# EAGLE schematic Power (EAGLE 7.1.0)
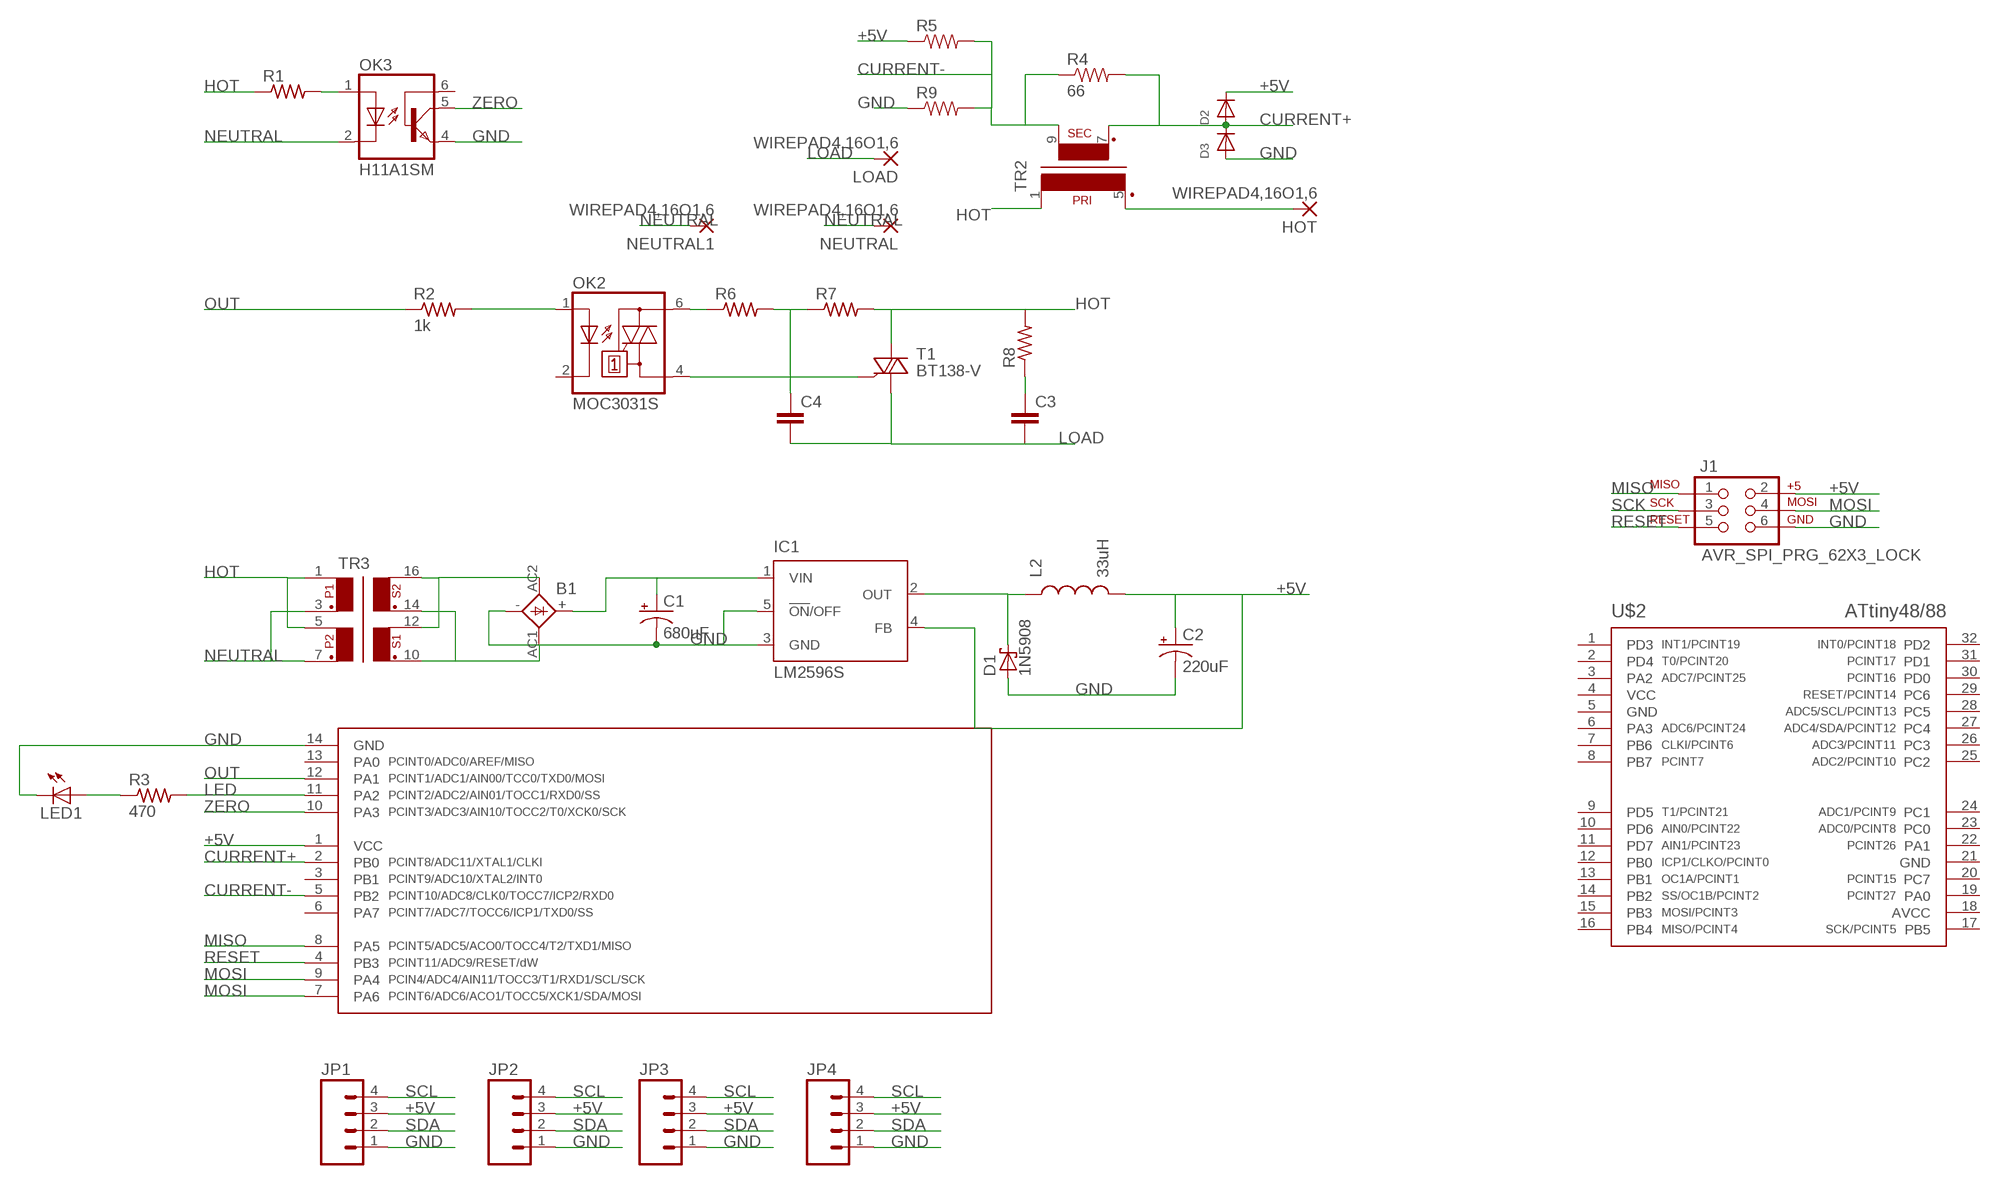
[diagram p0: schematic, sheet 1]

## Parts
B1  GBU4  [GBU4S]
C1  680uF  CAP_POLH13  [PANASONIC_H13]
C2  220uF  CAP_POLD  [PANASONIC_D]
C3  C-EUC1206  [C1206]
C4  C-EUC1206  [C1206]
D1  1N5908  [C4111-15]
D2  DIODESMA  [SMADIODE]
D3  DIODESMA  [SMADIODE]
HOT  WIREPAD4,16O1,6  [4,16O1,6]
IC1  LM2596S  [TO263-5]
J1  AVR_SPI_PRG_62X3_LOCK  [2X3_LOCK]
JP1  M04JST-PTH  [JST-4-PTH]
JP2  M04JST-PTH  [JST-4-PTH]
JP3  M04JST-PTH  [JST-4-PTH]
JP4  M04JST-PTH  [JST-4-PTH]
L2  33uH  INDUCTORBOURNS_SRN6045  [SRN6045]
LED1  LED1206  [LED-1206]
LOAD  WIREPAD4,16O1,6  [4,16O1,6]
NEUTRAL  WIREPAD4,16O1,6  [4,16O1,6]
NEUTRAL1  WIREPAD4,16O1,6  [4,16O1,6]
OK2  MOC3031S  [DIL6-SMD]
OK3  H11A1SM  [DIL6-SMD]
R1  R-US_R1206  [R1206]
R2  1k  R-US_R1206  [R1206]
R3  470  R-US_R1206  [R1206]
R4  66  RESISTOR1206  [1206]
R5  RESISTOR1206  [1206]
R6  R-US_R1206  [R1206]
R7  R-US_R1206  [R1206]
R8  R-US_R1206  [R1206]
R9  RESISTOR1206  [1206]
T1  BT138-V  [TO220BV]
TR2  VV11  [VV11]
TR3  FT04-10  [FT04-10]
U$1  TINY841  [SOIC14]
U$2  ATTINY48/88-TQFP  [TQFP-32]

## Nets
+5V: C2.+ D2.C IC1.4(FB) J1.2 JP1.3 JP2.3 JP3.3 JP4.3 L2.2 R5.1 U$1.1(VCC)
CURRENT+: D2.A D3.C R4.2 TR2.7(S3) U$1.2(PB0)
CURRENT-: R4.1 R5.2 R9.2 TR2.9(S4) U$1.5(PB2)
GND: B1.- C1.- C2.- D1.A D3.A IC1.3(GND) IC1.5(!ON!/OFF) J1.6 JP1.1 JP2.1 JP3.1 JP4.1 LED1.C OK3.4(EMI) R9.1 U$1.14(GND)
HOT: R1.1 R7.2 R8.2 T1.T2(A2) TR2.1 TR3.1 TR3.5
LED: R3.2 U$1.11(PA2)
LOAD: C3.2 C4.2 LOAD.1(P) T1.T1(A1)
MISO: J1.1 U$1.8(PA5)
MOSI: J1.4 U$1.7(PA6) U$1.9(PA4)
N$1: OK2.4(A1) T1.G
N$2: OK3.1(A) R1.2
N$3: OK2.1(A) R2.2
N$4: OK2.6(A2) R6.1
N$5: D1.C IC1.2(OUT) L2.1
N$6: LED1.A R3.1
N$8: HOT.1(P) TR2.5(P2)
N$9: B1.AC1(AC2) TR3.10 TR3.14
N$10: B1.AC2(AC1) TR3.12 TR3.16
N$11: B1.+ C1.+ IC1.1(VIN)
N$13: C4.1 R6.2 R7.1
N$14: C3.1 R8.1
NEUTRAL: NEUTRAL1.1(P) NEUTRAL.1(P) OK3.2(C) TR3.3 TR3.7
OUT: R2.1 U$1.12(PA1)
RESET: J1.5 U$1.4(PB3)
SCK: J1.3
SCL: JP1.4 JP2.4 JP3.4 JP4.4
SDA: JP1.2 JP2.2 JP3.2 JP4.2
ZERO: OK3.5(COL) U$1.10(PA3)
Unconnected: OK2.2(C) OK3.6(BAS) U$1.3(PB1) U$1.6(PA7) U$1.13(PA0) U$2.1(PD3) U$2.2(PD4) U$2.3(PA2) U$2.4(VCC) U$2.5(GND) U$2.6(PA3) U$2.7(PB6) U$2.8(PB7) U$2.9(PD5) U$2.10(PD6) U$2.11(PD7) U$2.12(PB0) U$2.13(PB1) U$2.14(PB2) U$2.15(PB3) U$2.16(PB4) U$2.17(PB5) U$2.19(PA0) U$2.20(PC7) U$2.21(GND) U$2.22(PA1) U$2.23(PC0) U$2.24(PC1) U$2.25(PC2) U$2.26(PC3) U$2.27(PC4) U$2.28(PC5) U$2.29(PC6) U$2.30(PD0) U$2.31(PD1) U$2.32(PD2)

## Power pins joined to a net without a drawn wire
AVCC: U$2.18(AVCC)

## Library data of the parts
B1 = rectifier:GBU4: GENERAL INSTRUMENT RECTIFIER
C1 C2 = SparkFun-Passives:CAP_POL: Capacitor Polarized These are standard SMD and PTH capacitors. Normally 10uF, 47uF, and 100uF in electrolytic and tantalum varieties. Always verify the external diameter of the through hole cap, it varies with capacity, voltage, and manufacturer. The EIA devices should be standard.
C3 C4 = resistor:C-EU: CAPACITOR, European symbol
D1 = diode:1N5908: DIODE schottky
D2 D3 = adafruit:DIODE: Diode SMADIODE - SMA Surface Mount Package 20V 1A Schottky Diode Digikey: 641-1014-6-ND DO-1N4148 - Through Hole Small Current Diode SOD-123 20V 1 A (.5mV Vf) Schottky Diode - Digikey: MBRX120TPMSCT-ND SOD-323 10V 570mA (.38mV Vf, 3ns) Schottky Diode - Digikey: ZLLS410CT-ND SOD-523 30V 30mA Schottky Diode (RB751S-40TE61) - Digikey: RB751S-40TE61CT-ND SOT23-R/W - SOT23 Package (R = Solder Paste/Reflow Ovens, W = Hand-Soldering) BAT54Film 40V 300mA - Digikey: 497-7162-1-ND
HOT LOAD NEUTRAL NEUTRAL1 = wirepad:WIREPAD: Wire PAD connect wire on PCB
IC1 = national-semiconductor:LM2596: SIMPLE SWITCHER® Power Converter 150 kHz 3A Step-Down Voltage Regulator Source: http://www.national.com/ds/LM/LM2596.pdf; MF: NATIONAL SEMICONDUCTOR; MPN: LM2596S-ADJ/NOPB; OC_FARNELL: 9494367; OC_NEWARK: 41K3842
J1 = SparkFun-Connectors:AVR_SPI_PRG_6: AVR ISP 6 Pin This is the reduced ISP connector for AVR programming. Common on Arduino. This footprint will take up less PCB space and can be used with a 10-pin to 6-pin adapter such as SKU: BOB-08508
JP1-JP4 = SparkFun-Connectors:M04: Header 4 Standard 4-pin 0.1" header. Use with straight break away headers (SKU : PRT-00116), right angle break away headers (PRT-00553), swiss pins (PRT-00743), machine pins (PRT-00117), and female headers (PRT-00115). Molex polarized connector foot print use with SKU : PRT-08231 with associated crimp pins and housings. 1MM SMD Version SKU: PRT-10208; SKU: PRT-09916
L2 = SparkFun-Passives:INDUCTOR: Inductors Basic Inductor/Choke - 0603 and 1206. Footprints are not proven and vary greatly between part numbers. SRN6045- 33uH, 20% 1.4A SDR0403-560KL - 56uH, 10%, 500mA RMS/740mA peak; PROD_ID: NDUC-11627
LED1 = SparkFun-LED:LED: LEDs Standard schematic elements and footprints for 5mm, 3mm, 1206, and 0603 sized LEDs. 5mm - Spark Fun Electronics SKU : COM-00529 (and others)
OK2 = optocoupler:MOC30*: 6-Pin DIP Zero-Cross Optoisolators Triac Driver Output (250/400 Volt Peak) Source: Data sheet <http://www.fairchildsemi.com/ds/MO/MOC3031M.pdf> The old path of data sheet not more available 2013-05-06.; MF: FAIRCHILD SEMICONDUCTOR; MPN: MOC3031SM; OC_FARNELL: unknown; OC_NEWARK: 34C1335
OK3 = optocoupler:H11A*?M: General Purpose 6-Pin Phototransistor Optocouplers Source: http://www.fairchildsemi.com/ds/4N/4N35-M.pdf; OC_FARNELL: unknown; OC_NEWARK: unknown
R1-R3 R6-R8 = resistor:R-US_: RESISTOR, American symbol
R4 R5 R9 = SparkFun-Resistors:RESISTOR: Resistor Basic schematic elements and footprints for 0603, 1206, and PTH resistors.
T1 = triac:BT138: TRIAC Source: http://www.semiconductors.philips.com BT138_SERIES_2.pdf
TR2 = trafo:VV11: TRANSFORMER 1 primary winding, 1 secondary winding BLOCK
TR3 = trafo:FT04-10: TRANSFORMER 2 primary winding, 2 secondary windings, mounting holes ERA
U$1 = IntegerLabs:TINY841
U$2 = IntegerLabs:ATTINY48/88